# Altium schematic sheet МПСУ.464342.21-005 Э3 Лист4.SchDoc
size 297 x 209 mm; Address1: Address1; Address2: Address2; Address3: Address3; Address4: Address4; SheetNumber: 5; SheetTotal: 5; Scale: 1:1; Обозначение документа: МПСУ.464342.21-005 Э3
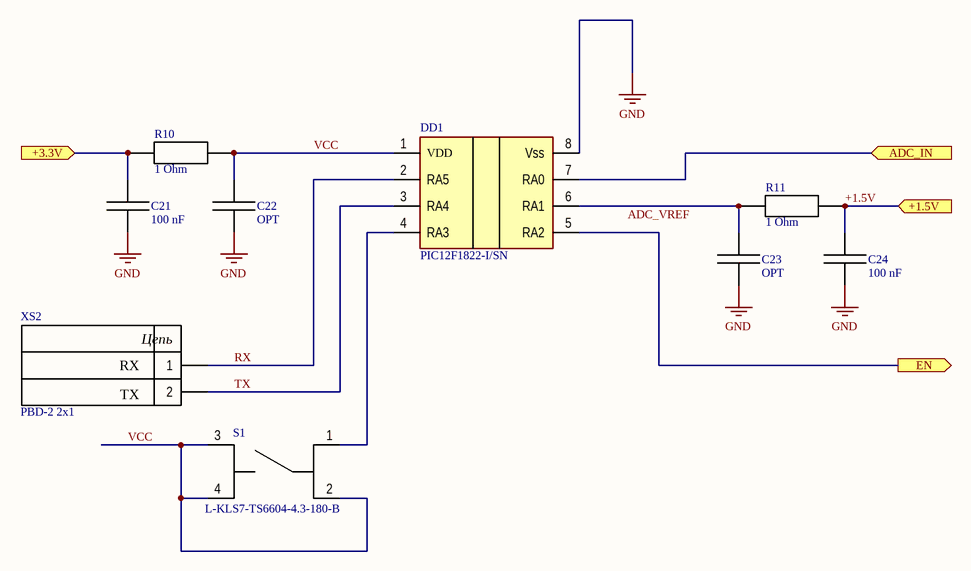
[diagram p0: МПСУ.464342.21-005 Э3 Лист4.SchDoc]

## Parts
C21  100 nF  [CAPC100X50X55L20N]
C22  OPT  [CAPC100X50X55L20N]
C23  OPT  [CAPC100X50X55L20N]
C24  100 nF  [CAPC100X50X55L20N]
DD1  PIC12F1822-I/SN  [SN-SOIC127P600X175-8N]
R10  1 Ohm  [RESC100X50X40L25N]
R11  1 Ohm  [RESC100X50X40L25N]
S1  L-KLS7-TS6604-4.3-180-B  [DIP2_SOIC450P1000X350-4N]
XS2  PBD-2 2x1  [RHDRV2W45P254_1X2_304X500H500]

## Ports
+1.5V (in), +3.3V (in), ADC_IN (in), EN (out)

## Nets
GND: C21.1 C22.1 C23.1 C24.1 DD1.8(Vss)
+1.5V: C24.2 R11.2 ; port +1.5V
+3.3V: C21.2 R10.2 ; port +3.3V
ADC_IN: DD1.7(RA0) ; port ADC_IN
ADC_VREF: C23.2 DD1.6(RA1) R11.1
EN: DD1.5(RA2) ; port EN
RX: DD1.2(RA5) XS2.1
TX: DD1.3(RA4) XS2.2
VCC: C22.2 DD1.1(VDD) R10.1 S1.2 S1.3 S1.4
NetDD1_4: DD1.4(RA3) S1.1

## Notes on the sheet
- Подп. и дата
- Инв. № дубл.
- Взам. инв. №
- Инв. № подл.
- Изм.
- Лист
- № докум.
- Подп.
- Дата
- Копировал
- Формат А4
- (in symbol PBD-2) Цепь

## Library data of the parts
C21-C24 = Capacitor: Capacitor, generic; PartNumber: *; Tolerance: *; VDC: *; Dielectric: *; Manufacturer: *; Package: 0402
  C21 C24: Value: 100 nF
  C22 C23: Value: OPT
DD1 = PIC12(L)F1822: 8-bit Flash Microcontrollers with XLP Technology 3.5 KB, 128 B; PartNumber: PIC12F1822-I/SN
R10 = Resistor: Resistor, generic; Value: 1 Ohm; PartNumber: *; Tolerance: *; Power: *; DCV: *; Manufacturer: *; Package: 0402
R11 = Resistor: Resistor, generic; Value: 10; PartNumber: *; Tolerance: *; Power: *; DCV: *; Manufacturer: *; Package: 0402
S1 = KLS7-TS6601-7: Tact Switch; Manufacturer: KLS electronic co ltd; PartNumber: L-KLS7-TS6604-4.3-180-B; ComponentLink1Description: DataSheet; ComponentLink1URL: https://static.chipdip.ru/lib/551/DOC001551970.pdf
XS2 = PBD-2: Header, Vertical Receptacle, 2.54 mm pitch 2x1; Net2: TX; Net1: RX; PartNumber: PBD-2 2x1